# EasyEDA Pro project SCH_and_PCB.epro, schematic 霍尔起跑检测aht
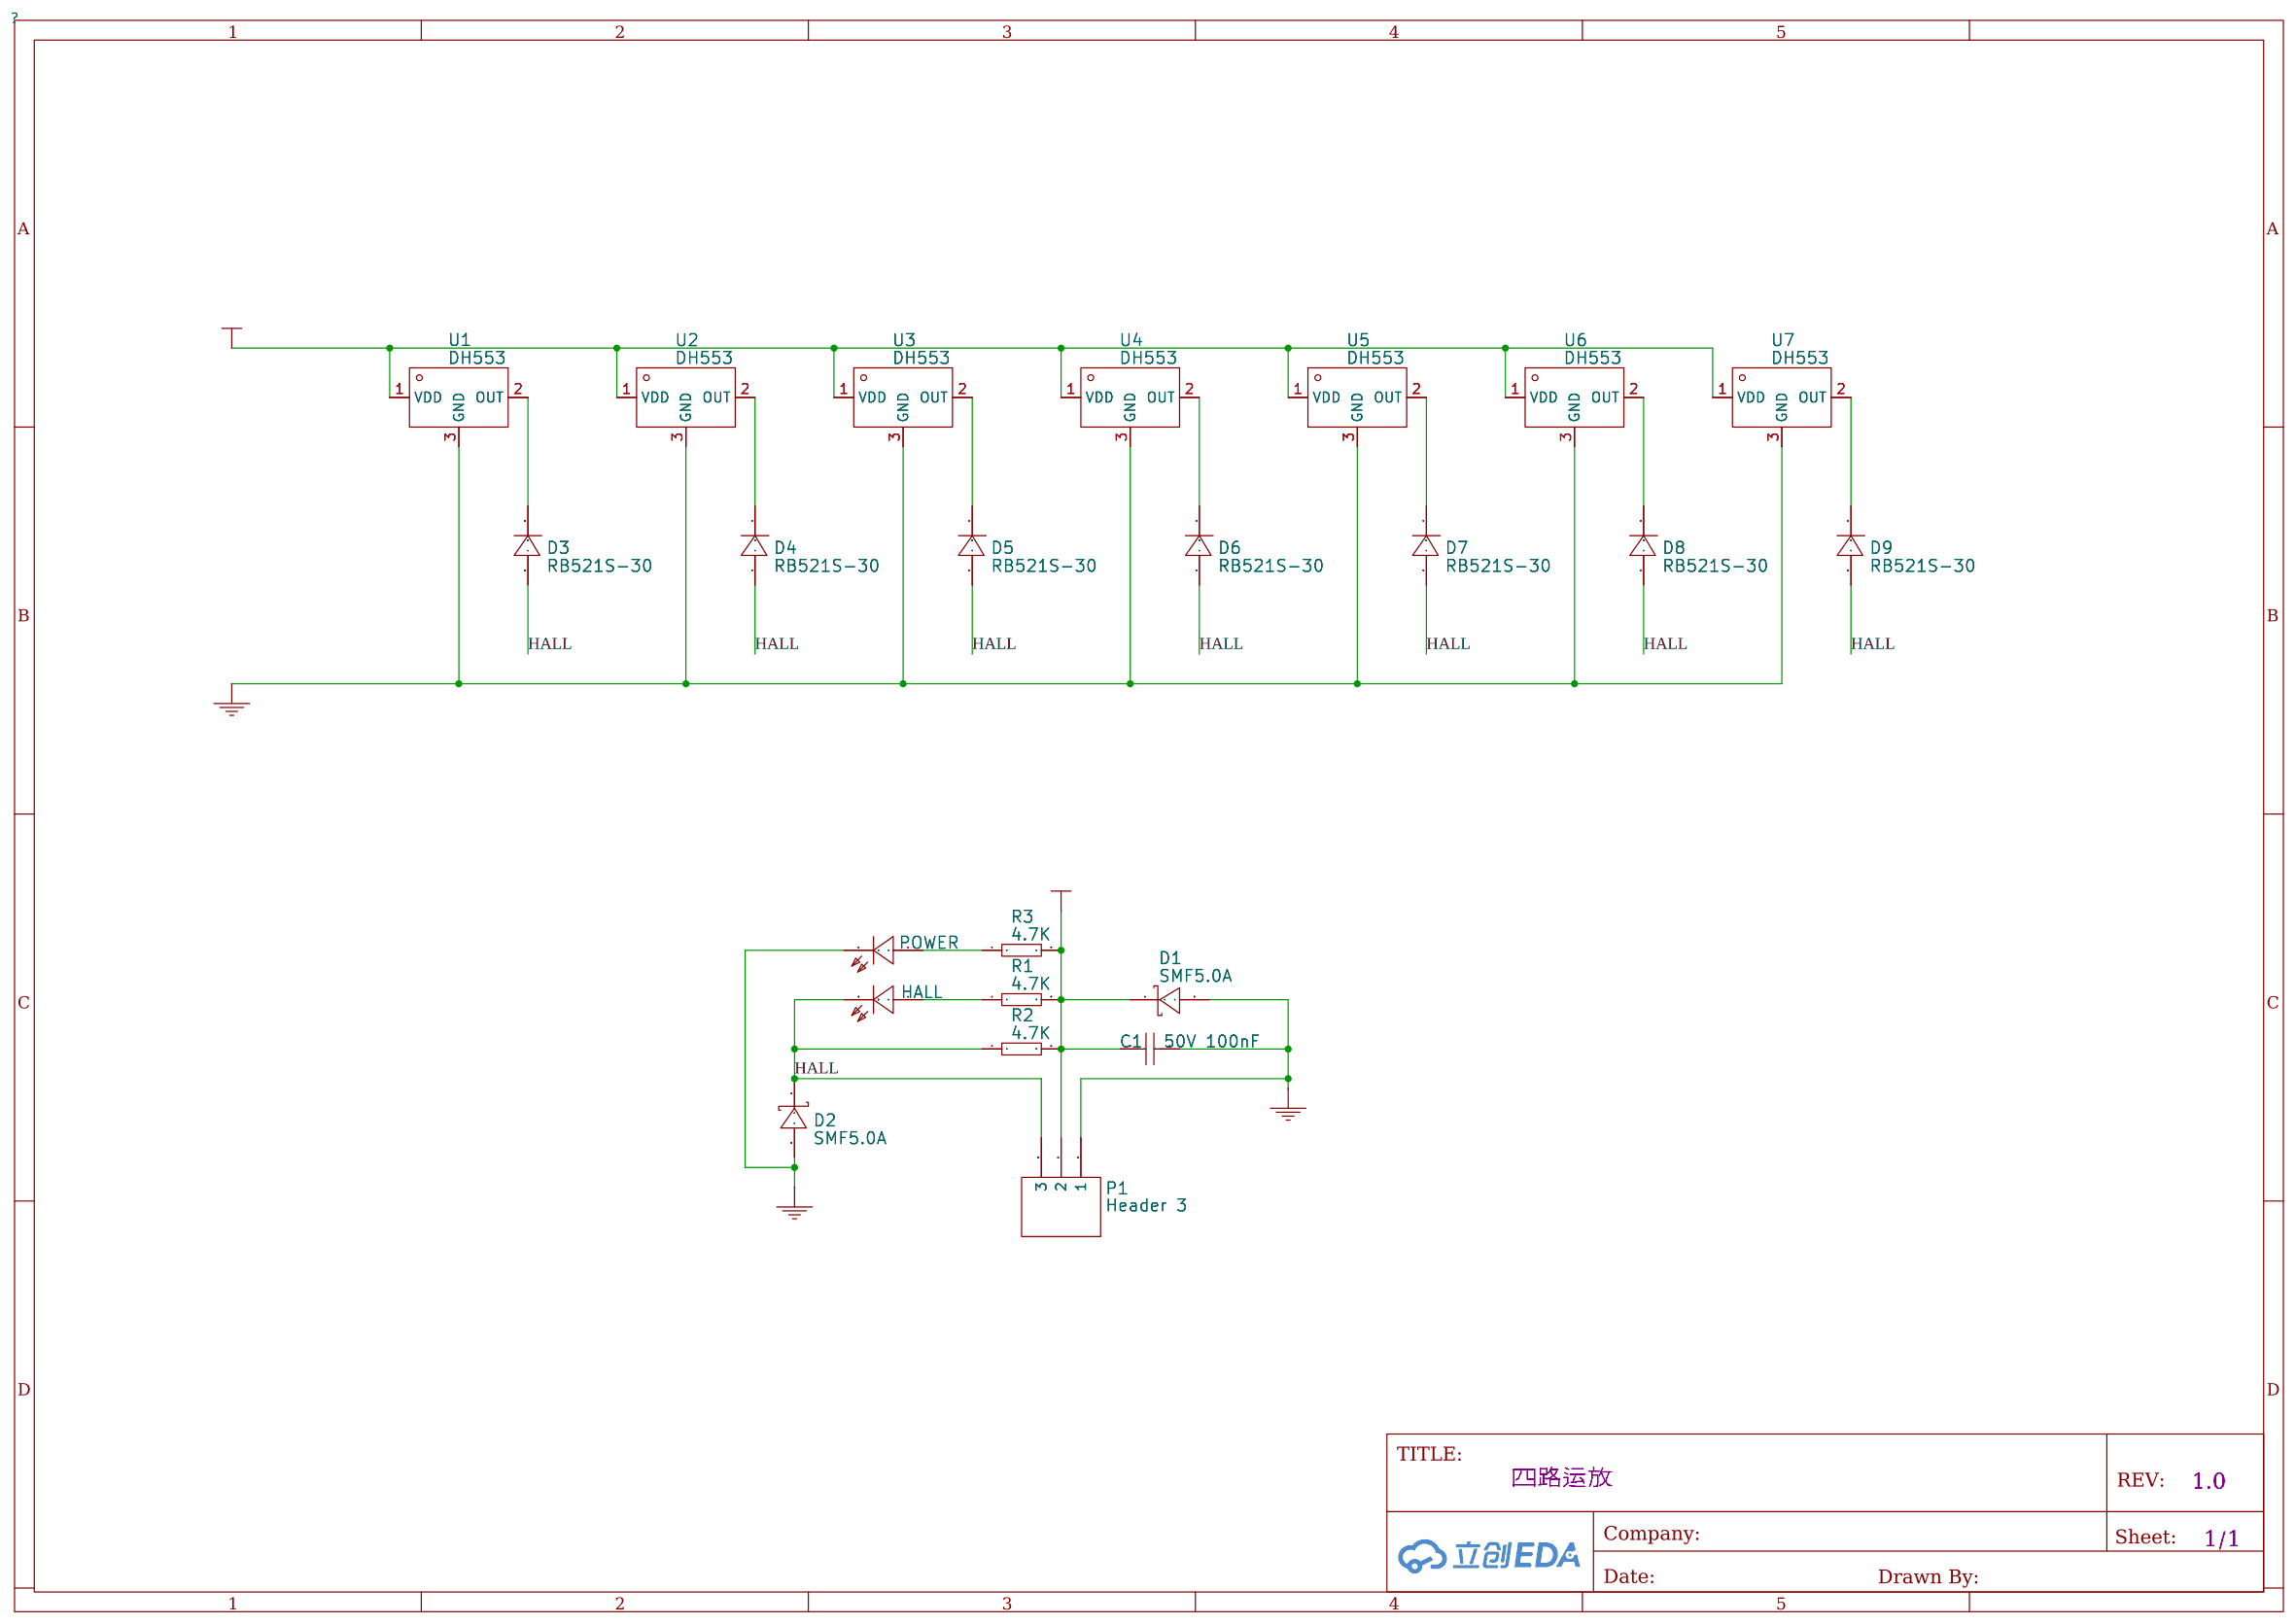
[diagram p5: schematic sheet]

## Parts
C1  50V 100nF  [CAPC1608[0603]S-N]
D1  SMF5.0A  [SOD-123_L2.8-W1.8-LS3.7-RD]
D2  SMF5.0A  [SOD-123_L2.8-W1.8-LS3.7-RD]
D3  RB521S-30  [SOD-523_L1.2-W0.8-LS1.6-RD]
D4  RB521S-30  [SOD-523_L1.2-W0.8-LS1.6-RD]
D5  RB521S-30  [SOD-523_L1.2-W0.8-LS1.6-RD]
D6  RB521S-30  [SOD-523_L1.2-W0.8-LS1.6-RD]
D7  RB521S-30  [SOD-523_L1.2-W0.8-LS1.6-RD]
D8  RB521S-30  [SOD-523_L1.2-W0.8-LS1.6-RD]
D9  RB521S-30  [SOD-523_L1.2-W0.8-LS1.6-RD]
HALL  LED Chip Blue  [LEDC1608(0603)]
P1  Header 3  [HDR1X3]
POWER  LED Chip Red  [LEDC1608(0603)]
R1  4.7K  [0603_RES]
R2  4.7K  [0603_RES]
R3  4.7K  [0603_RES]
U1  DH553  [SOT-23-3_L2.9-W1.6-P1.90-LS2.8-BR]
U2  DH553  [SOT-23-3_L2.9-W1.6-P1.90-LS2.8-BR]
U3  DH553  [SOT-23-3_L2.9-W1.6-P1.90-LS2.8-BR]
U4  DH553  [SOT-23-3_L2.9-W1.6-P1.90-LS2.8-BR]
U5  DH553  [SOT-23-3_L2.9-W1.6-P1.90-LS2.8-BR]
U6  DH553  [SOT-23-3_L2.9-W1.6-P1.90-LS2.8-BR]
U7  DH553  [SOT-23-3_L2.9-W1.6-P1.90-LS2.8-BR]

## Library data of the parts
C1 = 50V 100nF: Published: 8-Jun-2000; LatestRevisionDate: 17-Jul-2002; LatestRevisionNote: Re-released for DXP Platform.; PackageReference: RAD-0.3; Publisher: Altium Limited; PackageDescription: Radial Cap, Thru-Hole; 2 Leads; 0.3 in Pin Spacing; Comment: Cap
D1 D2 = SMF5.0A: link: https://item.szlcsc.com/301422.html; Supplier: LCSC; Manufacturer: Yenji; Supplier Part: C132591; JLCPCB Part Class: ExtendedPart
D3-D9 = RB521S-30: link: https://item.szlcsc.com/10573.html; 3DModel: SOD-523_L1.2-W0.8-H0.7-LS1.6; Supplier: LCSC; Manufacturer: SK; Supplier Part: C122862; JLCPCB Part Class: ExtendedPart
HALL = LED Chip Blue: Published: 8-Jun-2000; Revision: July-2002: Re-released for DXP Platform.; Publisher: Altium Limited; Price(RMB): 0.00; Color: Blue
P1 = Header 3: LatestRevisionDate: 17-Jul-2002; LatestRevisionNote: Re-released for DXP Platform.; Publisher: Altium Limited; Price(RMB): 0.00
POWER = LED Chip Red: Published: 8-Jun-2000; Revision: July-2002: Re-released for DXP Platform.; Publisher: Altium Limited; Price(RMB): 0.00
R1-R3 = 4.7K: Published: 8-Jun-2000; Revision: July-2002: Re-released for DXP Platform.; Publisher: Altium Limited; Price(RMB): 0.000; Tolerance: ±1%
U1-U7 = DH553: link: https://item.szlcsc.com/14454.html; 3DModel: SOT-23-3L_L2.9-W1.6-H1.1-LS2.8-P0.95; Supplier: LCSC; Supplier Part: C9900017055; Manufacturer: null; JLCPCB Part Class: ExtendedPart

## Nets
GND: C1.2 D1.2(A) D2.2(A) P1.1 POWER.C U1.3(GND) U2.3(GND) U3.3(GND) U4.3(GND) U5.3(GND) U6.3(GND) U7.3(GND)
VCC: C1.1 D1.1(K) P1.2 R1.2 R2.2 R3.2 U1.1(VDD) U2.1(VDD) U3.1(VDD) U4.1(VDD) U5.1(VDD) U6.1(VDD) U7.1(VDD)
HALL: D2.1(K) D3.2(A) D4.2(A) D5.2(A) D6.2(A) D7.2(A) D8.2(A) D9.2(A) HALL.C P1.3 R2.1
R1_1: HALL.A R1.1
R3_1: POWER.A R3.1
U1_2: D3.1(C) U1.2(OUT)
U2_2: D4.1(C) U2.2(OUT)
U3_2: D5.1(C) U3.2(OUT)
U4_2: D6.1(C) U4.2(OUT)
U5_2: D7.1(C) U5.2(OUT)
U6_2: D8.1(C) U6.2(OUT)
U7_2: D9.1(C) U7.2(OUT)
